# Altium schematic sheet RELAYS.SchDoc
size 594 x 420 mm
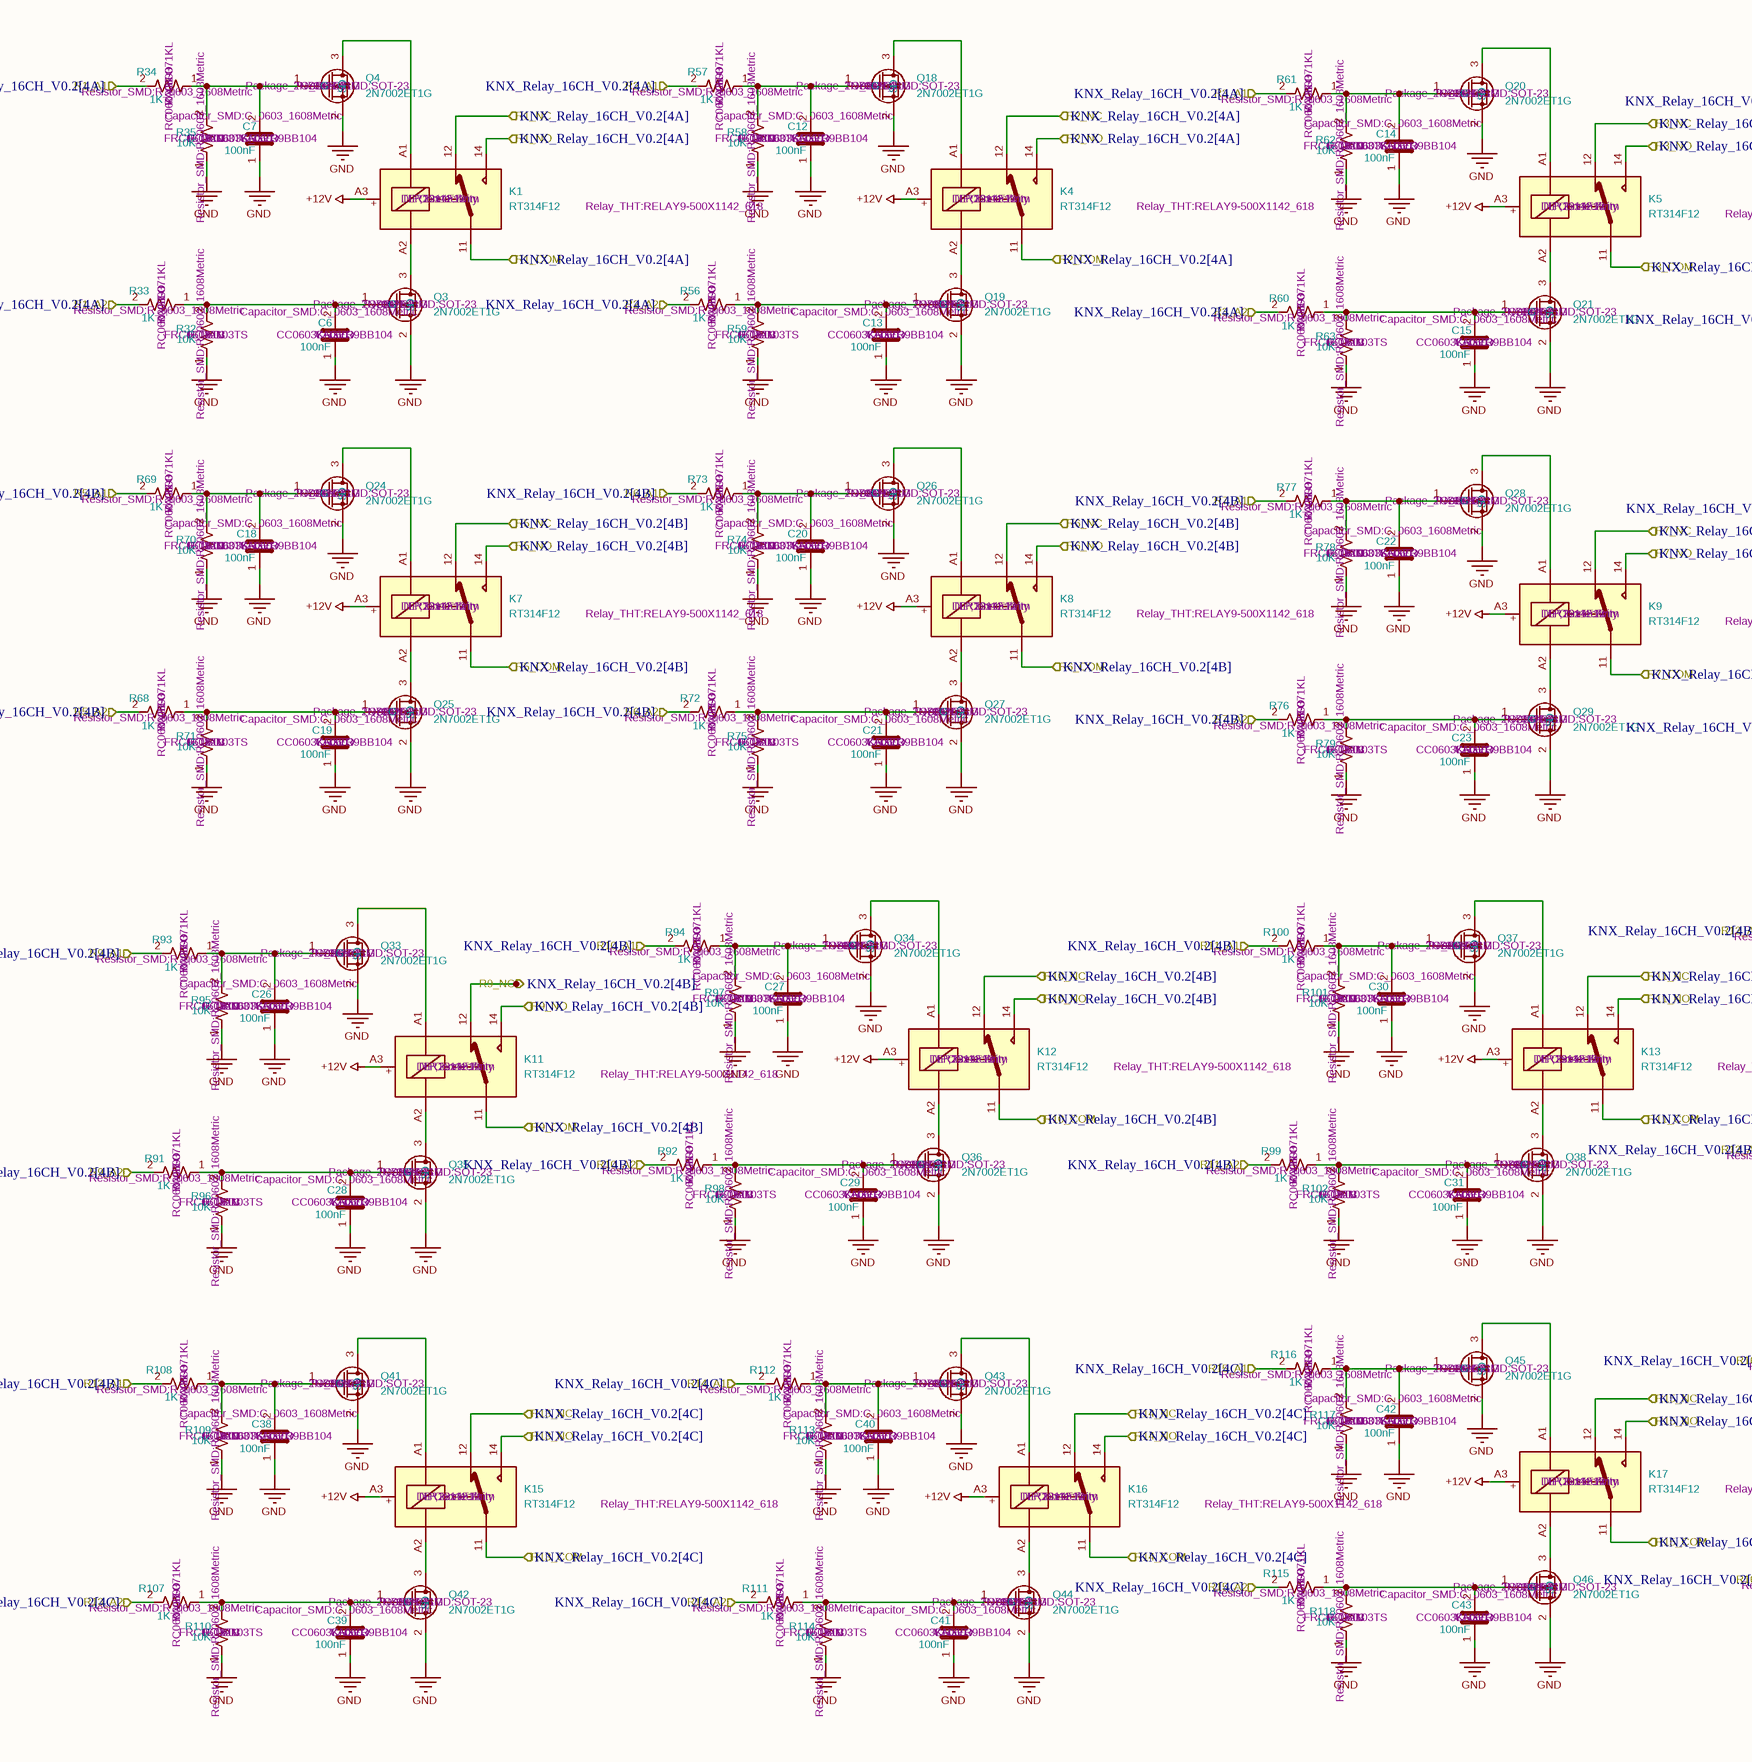
[diagram p0: RELAYS.SchDoc, left]
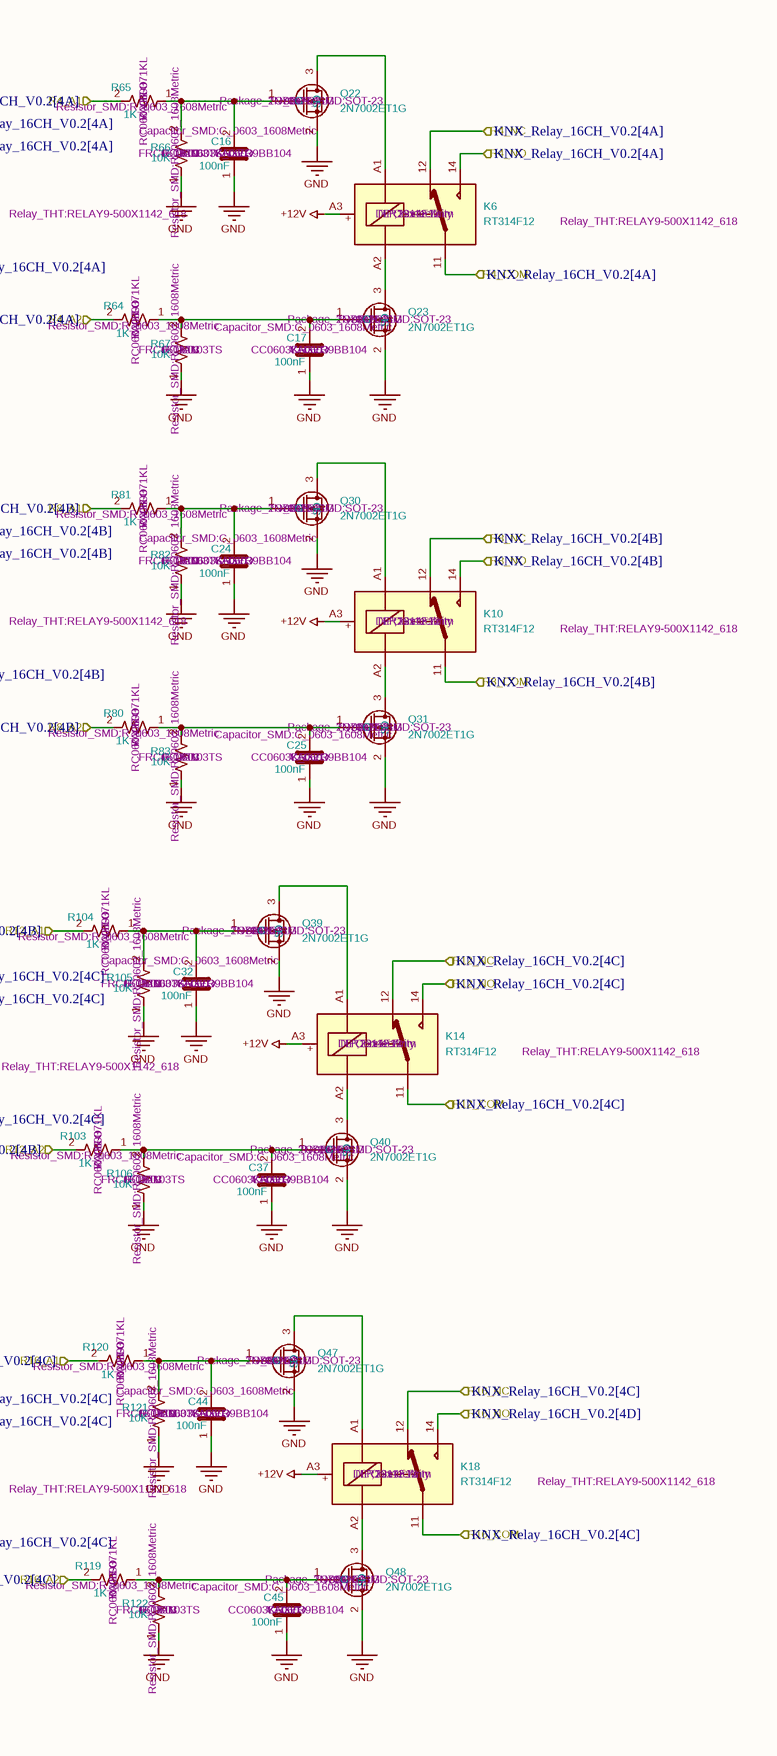
[diagram p1: RELAYS.SchDoc, right]

## Parts
C6  Manufacturer Part Number: CC0603KRX7R9BB104  Manufacturer: YAGEO  Package: C_0603  Footprint: Capacitor_SMD:C_0603_1608Metric  [C_0603_1608Metric]  (hidden comment: 100nF)
C7  Manufacturer Part Number: CC0603KRX7R9BB104  Manufacturer: YAGEO  Package: C_0603  Footprint: Capacitor_SMD:C_0603_1608Metric  [C_0603_1608Metric]  (hidden comment: 100nF)
C12  Manufacturer Part Number: CC0603KRX7R9BB104  Manufacturer: YAGEO  Package: C_0603  Footprint: Capacitor_SMD:C_0603_1608Metric  [C_0603_1608Metric]  (hidden comment: 100nF)
C13  Manufacturer Part Number: CC0603KRX7R9BB104  Manufacturer: YAGEO  Package: C_0603  Footprint: Capacitor_SMD:C_0603_1608Metric  [C_0603_1608Metric]  (hidden comment: 100nF)
C14  Manufacturer Part Number: CC0603KRX7R9BB104  Manufacturer: YAGEO  Package: C_0603  Footprint: Capacitor_SMD:C_0603_1608Metric  [C_0603_1608Metric]  (hidden comment: 100nF)
C15  Manufacturer Part Number: CC0603KRX7R9BB104  Manufacturer: YAGEO  Package: C_0603  Footprint: Capacitor_SMD:C_0603_1608Metric  [C_0603_1608Metric]  (hidden comment: 100nF)
C16  Manufacturer Part Number: CC0603KRX7R9BB104  Manufacturer: YAGEO  Package: C_0603  Footprint: Capacitor_SMD:C_0603_1608Metric  [C_0603_1608Metric]  (hidden comment: 100nF)
C17  Manufacturer Part Number: CC0603KRX7R9BB104  Manufacturer: YAGEO  Package: C_0603  Footprint: Capacitor_SMD:C_0603_1608Metric  [C_0603_1608Metric]  (hidden comment: 100nF)
C18  Manufacturer Part Number: CC0603KRX7R9BB104  Manufacturer: YAGEO  Package: C_0603  Footprint: Capacitor_SMD:C_0603_1608Metric  [C_0603_1608Metric]  (hidden comment: 100nF)
C19  Manufacturer Part Number: CC0603KRX7R9BB104  Manufacturer: YAGEO  Package: C_0603  Footprint: Capacitor_SMD:C_0603_1608Metric  [C_0603_1608Metric]  (hidden comment: 100nF)
C20  Manufacturer Part Number: CC0603KRX7R9BB104  Manufacturer: YAGEO  Package: C_0603  Footprint: Capacitor_SMD:C_0603_1608Metric  [C_0603_1608Metric]  (hidden comment: 100nF)
C21  Manufacturer Part Number: CC0603KRX7R9BB104  Manufacturer: YAGEO  Package: C_0603  Footprint: Capacitor_SMD:C_0603_1608Metric  [C_0603_1608Metric]  (hidden comment: 100nF)
C22  Manufacturer Part Number: CC0603KRX7R9BB104  Manufacturer: YAGEO  Package: C_0603  Footprint: Capacitor_SMD:C_0603_1608Metric  [C_0603_1608Metric]  (hidden comment: 100nF)
C23  Manufacturer Part Number: CC0603KRX7R9BB104  Manufacturer: YAGEO  Package: C_0603  Footprint: Capacitor_SMD:C_0603_1608Metric  [C_0603_1608Metric]  (hidden comment: 100nF)
C24  Manufacturer Part Number: CC0603KRX7R9BB104  Manufacturer: YAGEO  Package: C_0603  Footprint: Capacitor_SMD:C_0603_1608Metric  [C_0603_1608Metric]  (hidden comment: 100nF)
C25  Manufacturer Part Number: CC0603KRX7R9BB104  Manufacturer: YAGEO  Package: C_0603  Footprint: Capacitor_SMD:C_0603_1608Metric  [C_0603_1608Metric]  (hidden comment: 100nF)
C26  Manufacturer Part Number: CC0603KRX7R9BB104  Manufacturer: YAGEO  Package: C_0603  Footprint: Capacitor_SMD:C_0603_1608Metric  [C_0603_1608Metric]  (hidden comment: 100nF)
C27  Manufacturer Part Number: CC0603KRX7R9BB104  Manufacturer: YAGEO  Package: C_0603  Footprint: Capacitor_SMD:C_0603_1608Metric  [C_0603_1608Metric]  (hidden comment: 100nF)
C28  Manufacturer Part Number: CC0603KRX7R9BB104  Manufacturer: YAGEO  Package: C_0603  Footprint: Capacitor_SMD:C_0603_1608Metric  [C_0603_1608Metric]  (hidden comment: 100nF)
C29  Manufacturer Part Number: CC0603KRX7R9BB104  Manufacturer: YAGEO  Package: C_0603  Footprint: Capacitor_SMD:C_0603_1608Metric  [C_0603_1608Metric]  (hidden comment: 100nF)
C30  Manufacturer Part Number: CC0603KRX7R9BB104  Manufacturer: YAGEO  Package: C_0603  Footprint: Capacitor_SMD:C_0603_1608Metric  [C_0603_1608Metric]  (hidden comment: 100nF)
C31  Manufacturer Part Number: CC0603KRX7R9BB104  Manufacturer: YAGEO  Package: C_0603  Footprint: Capacitor_SMD:C_0603_1608Metric  [C_0603_1608Metric]  (hidden comment: 100nF)
C32  Manufacturer Part Number: CC0603KRX7R9BB104  Manufacturer: YAGEO  Package: C_0603  Footprint: Capacitor_SMD:C_0603_1608Metric  [C_0603_1608Metric]  (hidden comment: 100nF)
C37  Manufacturer Part Number: CC0603KRX7R9BB104  Manufacturer: YAGEO  Package: C_0603  Footprint: Capacitor_SMD:C_0603_1608Metric  [C_0603_1608Metric]  (hidden comment: 100nF)
C38  Manufacturer Part Number: CC0603KRX7R9BB104  Manufacturer: YAGEO  Package: C_0603  Footprint: Capacitor_SMD:C_0603_1608Metric  [C_0603_1608Metric]  (hidden comment: 100nF)
C39  Manufacturer Part Number: CC0603KRX7R9BB104  Manufacturer: YAGEO  Package: C_0603  Footprint: Capacitor_SMD:C_0603_1608Metric  [C_0603_1608Metric]  (hidden comment: 100nF)
C40  Manufacturer Part Number: CC0603KRX7R9BB104  Manufacturer: YAGEO  Package: C_0603  Footprint: Capacitor_SMD:C_0603_1608Metric  [C_0603_1608Metric]  (hidden comment: 100nF)
C41  Manufacturer Part Number: CC0603KRX7R9BB104  Manufacturer: YAGEO  Package: C_0603  Footprint: Capacitor_SMD:C_0603_1608Metric  [C_0603_1608Metric]  (hidden comment: 100nF)
C42  Manufacturer Part Number: CC0603KRX7R9BB104  Manufacturer: YAGEO  Package: C_0603  Footprint: Capacitor_SMD:C_0603_1608Metric  [C_0603_1608Metric]  (hidden comment: 100nF)
C43  Manufacturer Part Number: CC0603KRX7R9BB104  Manufacturer: YAGEO  Package: C_0603  Footprint: Capacitor_SMD:C_0603_1608Metric  [C_0603_1608Metric]  (hidden comment: 100nF)
C44  Manufacturer Part Number: CC0603KRX7R9BB104  Manufacturer: YAGEO  Package: C_0603  Footprint: Capacitor_SMD:C_0603_1608Metric  [C_0603_1608Metric]  (hidden comment: 100nF)
C45  Manufacturer Part Number: CC0603KRX7R9BB104  Manufacturer: YAGEO  Package: C_0603  Footprint: Capacitor_SMD:C_0603_1608Metric  [C_0603_1608Metric]  (hidden comment: 100nF)
K1  Manufacturer: TE Connectivity  Package: DIP,29x12.7mm  Footprint: Relay_THT:RELAY9-500X1142_618  [RELAY9-500X1142_618]  (hidden comment: RT314F12)
K4  Manufacturer: TE Connectivity  Package: DIP,29x12.7mm  Footprint: Relay_THT:RELAY9-500X1142_618  [RELAY9-500X1142_618]  (hidden comment: RT314F12)
K5  Manufacturer: TE Connectivity  Package: DIP,29x12.7mm  Footprint: Relay_THT:RELAY9-500X1142_618  [RELAY9-500X1142_618]  (hidden comment: RT314F12)
K6  Manufacturer: TE Connectivity  Package: DIP,29x12.7mm  Footprint: Relay_THT:RELAY9-500X1142_618  [RELAY9-500X1142_618]  (hidden comment: RT314F12)
K7  Manufacturer: TE Connectivity  Package: DIP,29x12.7mm  Footprint: Relay_THT:RELAY9-500X1142_618  [RELAY9-500X1142_618]  (hidden comment: RT314F12)
K8  Manufacturer: TE Connectivity  Package: DIP,29x12.7mm  Footprint: Relay_THT:RELAY9-500X1142_618  [RELAY9-500X1142_618]  (hidden comment: RT314F12)
K9  Manufacturer: TE Connectivity  Package: DIP,29x12.7mm  Footprint: Relay_THT:RELAY9-500X1142_618  [RELAY9-500X1142_618]  (hidden comment: RT314F12)
K10  Manufacturer: TE Connectivity  Package: DIP,29x12.7mm  Footprint: Relay_THT:RELAY9-500X1142_618  [RELAY9-500X1142_618]  (hidden comment: RT314F12)
K11  Manufacturer: TE Connectivity  Package: DIP,29x12.7mm  Footprint: Relay_THT:RELAY9-500X1142_618  [RELAY9-500X1142_618]  (hidden comment: RT314F12)
K12  Manufacturer: TE Connectivity  Package: DIP,29x12.7mm  Footprint: Relay_THT:RELAY9-500X1142_618  [RELAY9-500X1142_618]  (hidden comment: RT314F12)
K13  Manufacturer: TE Connectivity  Package: DIP,29x12.7mm  Footprint: Relay_THT:RELAY9-500X1142_618  [RELAY9-500X1142_618]  (hidden comment: RT314F12)
K14  Manufacturer: TE Connectivity  Package: DIP,29x12.7mm  Footprint: Relay_THT:RELAY9-500X1142_618  [RELAY9-500X1142_618]  (hidden comment: RT314F12)
K15  Manufacturer: TE Connectivity  Package: DIP,29x12.7mm  Footprint: Relay_THT:RELAY9-500X1142_618  [RELAY9-500X1142_618]  (hidden comment: RT314F12)
K16  Manufacturer: TE Connectivity  Package: DIP,29x12.7mm  Footprint: Relay_THT:RELAY9-500X1142_618  [RELAY9-500X1142_618]  (hidden comment: RT314F12)
K17  Manufacturer: TE Connectivity  Package: DIP,29x12.7mm  Footprint: Relay_THT:RELAY9-500X1142_618  [RELAY9-500X1142_618]  (hidden comment: RT314F12)
K18  Manufacturer: TE Connectivity  Package: DIP,29x12.7mm  Footprint: Relay_THT:RELAY9-500X1142_618  [RELAY9-500X1142_618]  (hidden comment: RT314F12)
Q3  Manufacturer: onsemi  Footprint: Package_TO_SOT_SMD:SOT-23  [SOT-23]  (hidden comment: 2N7002ET1G)
Q4  Manufacturer: onsemi  Footprint: Package_TO_SOT_SMD:SOT-23  [SOT-23]  (hidden comment: 2N7002ET1G)
Q18  Manufacturer: onsemi  Footprint: Package_TO_SOT_SMD:SOT-23  [SOT-23]  (hidden comment: 2N7002ET1G)
Q19  Manufacturer: onsemi  Footprint: Package_TO_SOT_SMD:SOT-23  [SOT-23]  (hidden comment: 2N7002ET1G)
Q20  Manufacturer: onsemi  Footprint: Package_TO_SOT_SMD:SOT-23  [SOT-23]  (hidden comment: 2N7002ET1G)
Q21  Manufacturer: onsemi  Footprint: Package_TO_SOT_SMD:SOT-23  [SOT-23]  (hidden comment: 2N7002ET1G)
Q22  Manufacturer: onsemi  Footprint: Package_TO_SOT_SMD:SOT-23  [SOT-23]  (hidden comment: 2N7002ET1G)
Q23  Manufacturer: onsemi  Footprint: Package_TO_SOT_SMD:SOT-23  [SOT-23]  (hidden comment: 2N7002ET1G)
Q24  Manufacturer: onsemi  Footprint: Package_TO_SOT_SMD:SOT-23  [SOT-23]  (hidden comment: 2N7002ET1G)
Q25  Manufacturer: onsemi  Footprint: Package_TO_SOT_SMD:SOT-23  [SOT-23]  (hidden comment: 2N7002ET1G)
Q26  Manufacturer: onsemi  Footprint: Package_TO_SOT_SMD:SOT-23  [SOT-23]  (hidden comment: 2N7002ET1G)
Q27  Manufacturer: onsemi  Footprint: Package_TO_SOT_SMD:SOT-23  [SOT-23]  (hidden comment: 2N7002ET1G)
Q28  Manufacturer: onsemi  Footprint: Package_TO_SOT_SMD:SOT-23  [SOT-23]  (hidden comment: 2N7002ET1G)
Q29  Manufacturer: onsemi  Footprint: Package_TO_SOT_SMD:SOT-23  [SOT-23]  (hidden comment: 2N7002ET1G)
Q30  Manufacturer: onsemi  Footprint: Package_TO_SOT_SMD:SOT-23  [SOT-23]  (hidden comment: 2N7002ET1G)
Q31  Manufacturer: onsemi  Footprint: Package_TO_SOT_SMD:SOT-23  [SOT-23]  (hidden comment: 2N7002ET1G)
Q33  Manufacturer: onsemi  Footprint: Package_TO_SOT_SMD:SOT-23  [SOT-23]  (hidden comment: 2N7002ET1G)
Q34  Manufacturer: onsemi  Footprint: Package_TO_SOT_SMD:SOT-23  [SOT-23]  (hidden comment: 2N7002ET1G)
Q35  Manufacturer: onsemi  Footprint: Package_TO_SOT_SMD:SOT-23  [SOT-23]  (hidden comment: 2N7002ET1G)
Q36  Manufacturer: onsemi  Footprint: Package_TO_SOT_SMD:SOT-23  [SOT-23]  (hidden comment: 2N7002ET1G)
Q37  Manufacturer: onsemi  Footprint: Package_TO_SOT_SMD:SOT-23  [SOT-23]  (hidden comment: 2N7002ET1G)
Q38  Manufacturer: onsemi  Footprint: Package_TO_SOT_SMD:SOT-23  [SOT-23]  (hidden comment: 2N7002ET1G)
Q39  Manufacturer: onsemi  Footprint: Package_TO_SOT_SMD:SOT-23  [SOT-23]  (hidden comment: 2N7002ET1G)
Q40  Manufacturer: onsemi  Footprint: Package_TO_SOT_SMD:SOT-23  [SOT-23]  (hidden comment: 2N7002ET1G)
Q41  Manufacturer: onsemi  Footprint: Package_TO_SOT_SMD:SOT-23  [SOT-23]  (hidden comment: 2N7002ET1G)
Q42  Manufacturer: onsemi  Footprint: Package_TO_SOT_SMD:SOT-23  [SOT-23]  (hidden comment: 2N7002ET1G)
Q43  Manufacturer: onsemi  Footprint: Package_TO_SOT_SMD:SOT-23  [SOT-23]  (hidden comment: 2N7002ET1G)
Q44  Manufacturer: onsemi  Footprint: Package_TO_SOT_SMD:SOT-23  [SOT-23]  (hidden comment: 2N7002ET1G)
Q45  Manufacturer: onsemi  Footprint: Package_TO_SOT_SMD:SOT-23  [SOT-23]  (hidden comment: 2N7002ET1G)
Q46  Manufacturer: onsemi  Footprint: Package_TO_SOT_SMD:SOT-23  [SOT-23]  (hidden comment: 2N7002ET1G)
Q47  Manufacturer: onsemi  Footprint: Package_TO_SOT_SMD:SOT-23  [SOT-23]  (hidden comment: 2N7002ET1G)
Q48  Manufacturer: onsemi  Footprint: Package_TO_SOT_SMD:SOT-23  [SOT-23]  (hidden comment: 2N7002ET1G)
R32  Manufacturer Part Number: FRC0603J103TS  Manufacturer: FOJAN  Package: R_0603  Footprint: Resistor_SMD:R_0603_1608Metric  [R_0603_1608Metric]  (hidden comment: 10K)
R33  Manufacturer Part Number: RC0603JR-071KL  Manufacturer: YAGEO  Package: R_0603  Footprint: Resistor_SMD:R_0603_1608Metric  [R_0603_1608Metric]  (hidden comment: 1K)
R34  Manufacturer Part Number: RC0603JR-071KL  Manufacturer: YAGEO  Package: R_0603  Footprint: Resistor_SMD:R_0603_1608Metric  [R_0603_1608Metric]  (hidden comment: 1K)
R35  Manufacturer Part Number: FRC0603J103TS  Manufacturer: FOJAN  Package: R_0603  Footprint: Resistor_SMD:R_0603_1608Metric  [R_0603_1608Metric]  (hidden comment: 10K)
R56  Manufacturer Part Number: RC0603JR-071KL  Manufacturer: YAGEO  Package: R_0603  Footprint: Resistor_SMD:R_0603_1608Metric  [R_0603_1608Metric]  (hidden comment: 1K)
R57  Manufacturer Part Number: RC0603JR-071KL  Manufacturer: YAGEO  Package: R_0603  Footprint: Resistor_SMD:R_0603_1608Metric  [R_0603_1608Metric]  (hidden comment: 1K)
R58  Manufacturer Part Number: FRC0603J103TS  Manufacturer: FOJAN  Package: R_0603  Footprint: Resistor_SMD:R_0603_1608Metric  [R_0603_1608Metric]  (hidden comment: 10K)
R59  Manufacturer Part Number: FRC0603J103TS  Manufacturer: FOJAN  Package: R_0603  Footprint: Resistor_SMD:R_0603_1608Metric  [R_0603_1608Metric]  (hidden comment: 10K)
R60  Manufacturer Part Number: RC0603JR-071KL  Manufacturer: YAGEO  Package: R_0603  Footprint: Resistor_SMD:R_0603_1608Metric  [R_0603_1608Metric]  (hidden comment: 1K)
R61  Manufacturer Part Number: RC0603JR-071KL  Manufacturer: YAGEO  Package: R_0603  Footprint: Resistor_SMD:R_0603_1608Metric  [R_0603_1608Metric]  (hidden comment: 1K)
R62  Manufacturer Part Number: FRC0603J103TS  Manufacturer: FOJAN  Package: R_0603  Footprint: Resistor_SMD:R_0603_1608Metric  [R_0603_1608Metric]  (hidden comment: 10K)
R63  Manufacturer Part Number: FRC0603J103TS  Manufacturer: FOJAN  Package: R_0603  Footprint: Resistor_SMD:R_0603_1608Metric  [R_0603_1608Metric]  (hidden comment: 10K)
R64  Manufacturer Part Number: RC0603JR-071KL  Manufacturer: YAGEO  Package: R_0603  Footprint: Resistor_SMD:R_0603_1608Metric  [R_0603_1608Metric]  (hidden comment: 1K)
R65  Manufacturer Part Number: RC0603JR-071KL  Manufacturer: YAGEO  Package: R_0603  Footprint: Resistor_SMD:R_0603_1608Metric  [R_0603_1608Metric]  (hidden comment: 1K)
R66  Manufacturer Part Number: FRC0603J103TS  Manufacturer: FOJAN  Package: R_0603  Footprint: Resistor_SMD:R_0603_1608Metric  [R_0603_1608Metric]  (hidden comment: 10K)
R67  Manufacturer Part Number: FRC0603J103TS  Manufacturer: FOJAN  Package: R_0603  Footprint: Resistor_SMD:R_0603_1608Metric  [R_0603_1608Metric]  (hidden comment: 10K)
R68  Manufacturer Part Number: RC0603JR-071KL  Manufacturer: YAGEO  Package: R_0603  Footprint: Resistor_SMD:R_0603_1608Metric  [R_0603_1608Metric]  (hidden comment: 1K)
R69  Manufacturer Part Number: RC0603JR-071KL  Manufacturer: YAGEO  Package: R_0603  Footprint: Resistor_SMD:R_0603_1608Metric  [R_0603_1608Metric]  (hidden comment: 1K)
R70  Manufacturer Part Number: FRC0603J103TS  Manufacturer: FOJAN  Package: R_0603  Footprint: Resistor_SMD:R_0603_1608Metric  [R_0603_1608Metric]  (hidden comment: 10K)
R71  Manufacturer Part Number: FRC0603J103TS  Manufacturer: FOJAN  Package: R_0603  Footprint: Resistor_SMD:R_0603_1608Metric  [R_0603_1608Metric]  (hidden comment: 10K)
R72  Manufacturer Part Number: RC0603JR-071KL  Manufacturer: YAGEO  Package: R_0603  Footprint: Resistor_SMD:R_0603_1608Metric  [R_0603_1608Metric]  (hidden comment: 1K)
R73  Manufacturer Part Number: RC0603JR-071KL  Manufacturer: YAGEO  Package: R_0603  Footprint: Resistor_SMD:R_0603_1608Metric  [R_0603_1608Metric]  (hidden comment: 1K)
R74  Manufacturer Part Number: FRC0603J103TS  Manufacturer: FOJAN  Package: R_0603  Footprint: Resistor_SMD:R_0603_1608Metric  [R_0603_1608Metric]  (hidden comment: 10K)
R75  Manufacturer Part Number: FRC0603J103TS  Manufacturer: FOJAN  Package: R_0603  Footprint: Resistor_SMD:R_0603_1608Metric  [R_0603_1608Metric]  (hidden comment: 10K)
R76  Manufacturer Part Number: RC0603JR-071KL  Manufacturer: YAGEO  Package: R_0603  Footprint: Resistor_SMD:R_0603_1608Metric  [R_0603_1608Metric]  (hidden comment: 1K)
R77  Manufacturer Part Number: RC0603JR-071KL  Manufacturer: YAGEO  Package: R_0603  Footprint: Resistor_SMD:R_0603_1608Metric  [R_0603_1608Metric]  (hidden comment: 1K)
R78  Manufacturer Part Number: FRC0603J103TS  Manufacturer: FOJAN  Package: R_0603  Footprint: Resistor_SMD:R_0603_1608Metric  [R_0603_1608Metric]  (hidden comment: 10K)
R79  Manufacturer Part Number: FRC0603J103TS  Manufacturer: FOJAN  Package: R_0603  Footprint: Resistor_SMD:R_0603_1608Metric  [R_0603_1608Metric]  (hidden comment: 10K)
R80  Manufacturer Part Number: RC0603JR-071KL  Manufacturer: YAGEO  Package: R_0603  Footprint: Resistor_SMD:R_0603_1608Metric  [R_0603_1608Metric]  (hidden comment: 1K)
R81  Manufacturer Part Number: RC0603JR-071KL  Manufacturer: YAGEO  Package: R_0603  Footprint: Resistor_SMD:R_0603_1608Metric  [R_0603_1608Metric]  (hidden comment: 1K)
R82  Manufacturer Part Number: FRC0603J103TS  Manufacturer: FOJAN  Package: R_0603  Footprint: Resistor_SMD:R_0603_1608Metric  [R_0603_1608Metric]  (hidden comment: 10K)
R83  Manufacturer Part Number: FRC0603J103TS  Manufacturer: FOJAN  Package: R_0603  Footprint: Resistor_SMD:R_0603_1608Metric  [R_0603_1608Metric]  (hidden comment: 10K)
R91  Manufacturer Part Number: RC0603JR-071KL  Manufacturer: YAGEO  Package: R_0603  Footprint: Resistor_SMD:R_0603_1608Metric  [R_0603_1608Metric]  (hidden comment: 1K)
R92  Manufacturer Part Number: RC0603JR-071KL  Manufacturer: YAGEO  Package: R_0603  Footprint: Resistor_SMD:R_0603_1608Metric  [R_0603_1608Metric]  (hidden comment: 1K)
R93  Manufacturer Part Number: RC0603JR-071KL  Manufacturer: YAGEO  Package: R_0603  Footprint: Resistor_SMD:R_0603_1608Metric  [R_0603_1608Metric]  (hidden comment: 1K)
R94  Manufacturer Part Number: RC0603JR-071KL  Manufacturer: YAGEO  Package: R_0603  Footprint: Resistor_SMD:R_0603_1608Metric  [R_0603_1608Metric]  (hidden comment: 1K)
R95  Manufacturer Part Number: FRC0603J103TS  Manufacturer: FOJAN  Package: R_0603  Footprint: Resistor_SMD:R_0603_1608Metric  [R_0603_1608Metric]  (hidden comment: 10K)
R96  Manufacturer Part Number: FRC0603J103TS  Manufacturer: FOJAN  Package: R_0603  Footprint: Resistor_SMD:R_0603_1608Metric  [R_0603_1608Metric]  (hidden comment: 10K)
R97  Manufacturer Part Number: FRC0603J103TS  Manufacturer: FOJAN  Package: R_0603  Footprint: Resistor_SMD:R_0603_1608Metric  [R_0603_1608Metric]  (hidden comment: 10K)
R98  Manufacturer Part Number: FRC0603J103TS  Manufacturer: FOJAN  Package: R_0603  Footprint: Resistor_SMD:R_0603_1608Metric  [R_0603_1608Metric]  (hidden comment: 10K)
R99  Manufacturer Part Number: RC0603JR-071KL  Manufacturer: YAGEO  Package: R_0603  Footprint: Resistor_SMD:R_0603_1608Metric  [R_0603_1608Metric]  (hidden comment: 1K)
R100  Manufacturer Part Number: RC0603JR-071KL  Manufacturer: YAGEO  Package: R_0603  Footprint: Resistor_SMD:R_0603_1608Metric  [R_0603_1608Metric]  (hidden comment: 1K)
R101  Manufacturer Part Number: FRC0603J103TS  Manufacturer: FOJAN  Package: R_0603  Footprint: Resistor_SMD:R_0603_1608Metric  [R_0603_1608Metric]  (hidden comment: 10K)
R102  Manufacturer Part Number: FRC0603J103TS  Manufacturer: FOJAN  Package: R_0603  Footprint: Resistor_SMD:R_0603_1608Metric  [R_0603_1608Metric]  (hidden comment: 10K)
R103  Manufacturer Part Number: RC0603JR-071KL  Manufacturer: YAGEO  Package: R_0603  Footprint: Resistor_SMD:R_0603_1608Metric  [R_0603_1608Metric]  (hidden comment: 1K)
R104  Manufacturer Part Number: RC0603JR-071KL  Manufacturer: YAGEO  Package: R_0603  Footprint: Resistor_SMD:R_0603_1608Metric  [R_0603_1608Metric]  (hidden comment: 1K)
R105  Manufacturer Part Number: FRC0603J103TS  Manufacturer: FOJAN  Package: R_0603  Footprint: Resistor_SMD:R_0603_1608Metric  [R_0603_1608Metric]  (hidden comment: 10K)
R106  Manufacturer Part Number: FRC0603J103TS  Manufacturer: FOJAN  Package: R_0603  Footprint: Resistor_SMD:R_0603_1608Metric  [R_0603_1608Metric]  (hidden comment: 10K)
R107  Manufacturer Part Number: RC0603JR-071KL  Manufacturer: YAGEO  Package: R_0603  Footprint: Resistor_SMD:R_0603_1608Metric  [R_0603_1608Metric]  (hidden comment: 1K)
R108  Manufacturer Part Number: RC0603JR-071KL  Manufacturer: YAGEO  Package: R_0603  Footprint: Resistor_SMD:R_0603_1608Metric  [R_0603_1608Metric]  (hidden comment: 1K)
R109  Manufacturer Part Number: FRC0603J103TS  Manufacturer: FOJAN  Package: R_0603  Footprint: Resistor_SMD:R_0603_1608Metric  [R_0603_1608Metric]  (hidden comment: 10K)
R110  Manufacturer Part Number: FRC0603J103TS  Manufacturer: FOJAN  Package: R_0603  Footprint: Resistor_SMD:R_0603_1608Metric  [R_0603_1608Metric]  (hidden comment: 10K)
R111  Manufacturer Part Number: RC0603JR-071KL  Manufacturer: YAGEO  Package: R_0603  Footprint: Resistor_SMD:R_0603_1608Metric  [R_0603_1608Metric]  (hidden comment: 1K)
R112  Manufacturer Part Number: RC0603JR-071KL  Manufacturer: YAGEO  Package: R_0603  Footprint: Resistor_SMD:R_0603_1608Metric  [R_0603_1608Metric]  (hidden comment: 1K)
R113  Manufacturer Part Number: FRC0603J103TS  Manufacturer: FOJAN  Package: R_0603  Footprint: Resistor_SMD:R_0603_1608Metric  [R_0603_1608Metric]  (hidden comment: 10K)
R114  Manufacturer Part Number: FRC0603J103TS  Manufacturer: FOJAN  Package: R_0603  Footprint: Resistor_SMD:R_0603_1608Metric  [R_0603_1608Metric]  (hidden comment: 10K)
R115  Manufacturer Part Number: RC0603JR-071KL  Manufacturer: YAGEO  Package: R_0603  Footprint: Resistor_SMD:R_0603_1608Metric  [R_0603_1608Metric]  (hidden comment: 1K)
R116  Manufacturer Part Number: RC0603JR-071KL  Manufacturer: YAGEO  Package: R_0603  Footprint: Resistor_SMD:R_0603_1608Metric  [R_0603_1608Metric]  (hidden comment: 1K)
R117  Manufacturer Part Number: FRC0603J103TS  Manufacturer: FOJAN  Package: R_0603  Footprint: Resistor_SMD:R_0603_1608Metric  [R_0603_1608Metric]  (hidden comment: 10K)
R118  Manufacturer Part Number: FRC0603J103TS  Manufacturer: FOJAN  Package: R_0603  Footprint: Resistor_SMD:R_0603_1608Metric  [R_0603_1608Metric]  (hidden comment: 10K)
R119  Manufacturer Part Number: RC0603JR-071KL  Manufacturer: YAGEO  Package: R_0603  Footprint: Resistor_SMD:R_0603_1608Metric  [R_0603_1608Metric]  (hidden comment: 1K)
R120  Manufacturer Part Number: RC0603JR-071KL  Manufacturer: YAGEO  Package: R_0603  Footprint: Resistor_SMD:R_0603_1608Metric  [R_0603_1608Metric]  (hidden comment: 1K)
R121  Manufacturer Part Number: FRC0603J103TS  Manufacturer: FOJAN  Package: R_0603  Footprint: Resistor_SMD:R_0603_1608Metric  [R_0603_1608Metric]  (hidden comment: 10K)
R122  Manufacturer Part Number: FRC0603J103TS  Manufacturer: FOJAN  Package: R_0603  Footprint: Resistor_SMD:R_0603_1608Metric  [R_0603_1608Metric]  (hidden comment: 10K)

## Ports
R1_A1 (in, see KNX_Relay_16CH_V0.2[4A]), R1_A2 (in, see KNX_Relay_16CH_V0.2[4A]), R1_COM (in, see KNX_Relay_16CH_V0.2[4A]), R1_NC (in, see KNX_Relay_16CH_V0.2[4A]), R1_NO (in, see KNX_Relay_16CH_V0.2[4A]), R2_A1 (in, see KNX_Relay_16CH_V0.2[4A]), R2_A2 (in, see KNX_Relay_16CH_V0.2[4A]), R2_COM (in, see KNX_Relay_16CH_V0.2[4A]), R2_NC (in, see KNX_Relay_16CH_V0.2[4A]), R2_NO (in, see KNX_Relay_16CH_V0.2[4A]), R3_A1 (in, see KNX_Relay_16CH_V0.2[4A]), R3_A2 (in, see KNX_Relay_16CH_V0.2[4A]), R3_COM (in, see KNX_Relay_16CH_V0.2[4A]), R3_NC (in, see KNX_Relay_16CH_V0.2[4A]), R3_NO (in, see KNX_Relay_16CH_V0.2[4A]), R4_A1 (in, see KNX_Relay_16CH_V0.2[4A]), R4_A2 (in, see KNX_Relay_16CH_V0.2[4A]), R4_COM (in, see KNX_Relay_16CH_V0.2[4A]), R4_NC (in, see KNX_Relay_16CH_V0.2[4A]), R4_NO (in, see KNX_Relay_16CH_V0.2[4A]), R5_A1 (in, see KNX_Relay_16CH_V0.2[4B]), R5_A2 (in, see KNX_Relay_16CH_V0.2[4B]), R5_COM (in, see KNX_Relay_16CH_V0.2[4B]), R5_NC (in, see KNX_Relay_16CH_V0.2[4B]), R5_NO (in, see KNX_Relay_16CH_V0.2[4B]), R6_A1 (in, see KNX_Relay_16CH_V0.2[4B]), R6_A2 (in, see KNX_Relay_16CH_V0.2[4B]), R6_COM (in, see KNX_Relay_16CH_V0.2[4B]), R6_NC (in, see KNX_Relay_16CH_V0.2[4B]), R6_NO (in, see KNX_Relay_16CH_V0.2[4B]), R7_A1 (in, see KNX_Relay_16CH_V0.2[4B]), R7_A2 (in, see KNX_Relay_16CH_V0.2[4B]), R7_COM (in, see KNX_Relay_16CH_V0.2[4B]), R7_NC (in, see KNX_Relay_16CH_V0.2[4B]), R7_NO (in, see KNX_Relay_16CH_V0.2[4B]), R8_A1 (in, see KNX_Relay_16CH_V0.2[4B]), R8_A2 (in, see KNX_Relay_16CH_V0.2[4B]), R8_COM (in, see KNX_Relay_16CH_V0.2[4B]), R8_NC (in, see KNX_Relay_16CH_V0.2[4B]), R8_NO (in, see KNX_Relay_16CH_V0.2[4B]), R9_A1 (in, see KNX_Relay_16CH_V0.2[4B]), R9_A2 (in, see KNX_Relay_16CH_V0.2[4B]), R9_COM (in, see KNX_Relay_16CH_V0.2[4B]), R9_NC (in, see KNX_Relay_16CH_V0.2[4B]), R9_NO (in, see KNX_Relay_16CH_V0.2[4B]), R10_A1 (in, see KNX_Relay_16CH_V0.2[4B]), R10_A2 (in, see KNX_Relay_16CH_V0.2[4B]), R10_COM (in, see KNX_Relay_16CH_V0.2[4B]), R10_NC (in, see KNX_Relay_16CH_V0.2[4B]), R10_NO (in, see KNX_Relay_16CH_V0.2[4B]), R11_A1 (in, see KNX_Relay_16CH_V0.2[4B]), R11_A2 (in, see KNX_Relay_16CH_V0.2[4B]), R11_COM (in, see KNX_Relay_16CH_V0.2[4C]), R11_NC (in, see KNX_Relay_16CH_V0.2[4C]), R11_NO (in, see KNX_Relay_16CH_V0.2[4C]), R12_A1 (in, see KNX_Relay_16CH_V0.2[4B]), R12_A2 (in, see KNX_Relay_16CH_V0.2[4B]), R12_COM (in, see KNX_Relay_16CH_V0.2[4C]), R12_NC (in, see KNX_Relay_16CH_V0.2[4C]), R12_NO (in, see KNX_Relay_16CH_V0.2[4C]), R13_A1 (in, see KNX_Relay_16CH_V0.2[4B]), R13_A2 (in, see KNX_Relay_16CH_V0.2[4C]), R13_COM (in, see KNX_Relay_16CH_V0.2[4C]), R13_NC (in, see KNX_Relay_16CH_V0.2[4C]), R13_NO (in, see KNX_Relay_16CH_V0.2[4C]), R14_A1 (in, see KNX_Relay_16CH_V0.2[4C]), R14_A2 (in, see KNX_Relay_16CH_V0.2[4C]), R14_COM (in, see KNX_Relay_16CH_V0.2[4C]), R14_NC (in, see KNX_Relay_16CH_V0.2[4C]), R14_NO (in, see KNX_Relay_16CH_V0.2[4C]), R15_A1 (in, see KNX_Relay_16CH_V0.2[4C]), R15_A2 (in, see KNX_Relay_16CH_V0.2[4C]), R15_COM (in, see KNX_Relay_16CH_V0.2[4C]), R15_NC (in, see KNX_Relay_16CH_V0.2[4C]), R15_NO (in, see KNX_Relay_16CH_V0.2[4C]), R16_A1 (in, see KNX_Relay_16CH_V0.2[4C]), R16_A2 (in, see KNX_Relay_16CH_V0.2[4C]), R16_COM (in, see KNX_Relay_16CH_V0.2[4C]), R16_NC (in, see KNX_Relay_16CH_V0.2[4C]), R16_NO (in, see KNX_Relay_16CH_V0.2[4D])

## Nets
+12V: K1.A3 K4.A3 K5.A3 K6.A3 K7.A3 K8.A3 K9.A3 K10.A3 K11.A3 K12.A3 K13.A3 K14.A3 K15.A3 K16.A3 K17.A3 K18.A3
GND: C6.1 C7.1 C12.1 C13.1 C14.1 C15.1 C16.1 C17.1 C18.1 C19.1 C20.1 C21.1 C22.1 C23.1 C24.1 C25.1 C26.1 C27.1 C28.1 C29.1 C30.1 C31.1 C32.1 C37.1 C38.1 C39.1 C40.1 C41.1 C42.1 C43.1 C44.1 C45.1 Q3.2(S) Q4.2(S) Q18.2(S) Q19.2(S) Q20.2(S) Q21.2(S) Q22.2(S) Q23.2(S) Q24.2(S) Q25.2(S) Q26.2(S) Q27.2(S) Q28.2(S) Q29.2(S) Q30.2(S) Q31.2(S) Q33.2(S) Q34.2(S) Q35.2(S) Q36.2(S) Q37.2(S) Q38.2(S) Q39.2(S) Q40.2(S) Q41.2(S) Q42.2(S) Q43.2(S) Q44.2(S) Q45.2(S) Q46.2(S) Q47.2(S) Q48.2(S) R32.1 R35.1 R58.1 R59.1 R62.1 R63.1 R66.1 R67.1 R70.1 R71.1 R74.1 R75.1 R78.1 R79.1 R82.1 R83.1 R95.1 R96.1 R97.1 R98.1 R101.1 R102.1 R105.1 R106.1 R109.1 R110.1 R113.1 R114.1 R117.1 R118.1 R121.1 R122.1
R1_A1: R34.2 ; port R1_A1
R1_A2: R33.2 ; port R1_A2
R1_COM: K1.11 ; port R1_COM
R1_NC: K1.12 ; port R1_NC
R1_NO: K1.14 ; port R1_NO
R2_A1: R57.2 ; port R2_A1
R2_A2: R56.2 ; port R2_A2
R2_COM: K4.11 ; port R2_COM
R2_NC: K4.12 ; port R2_NC
R2_NO: K4.14 ; port R2_NO
R3_A1: R61.2 ; port R3_A1
R3_A2: R60.2 ; port R3_A2
R3_COM: K5.11 ; port R3_COM
R3_NC: K5.12 ; port R3_NC
R3_NO: K5.14 ; port R3_NO
R4_A1: R65.2 ; port R4_A1
R4_A2: R64.2 ; port R4_A2
R4_COM: K6.11 ; port R4_COM
R4_NC: K6.12 ; port R4_NC
R4_NO: K6.14 ; port R4_NO
R5_A1: R69.2 ; port R5_A1
R5_A2: R68.2 ; port R5_A2
R5_COM: K7.11 ; port R5_COM
R5_NC: K7.12 ; port R5_NC
R5_NO: K7.14 ; port R5_NO
R6_A1: R73.2 ; port R6_A1
R6_A2: R72.2 ; port R6_A2
R6_COM: K8.11 ; port R6_COM
R6_NC: K8.12 ; port R6_NC
R6_NO: K8.14 ; port R6_NO
R7_A1: R77.2 ; port R7_A1
R7_A2: R76.2 ; port R7_A2
R7_COM: K9.11 ; port R7_COM
R7_NC: K9.12 ; port R7_NC
R7_NO: K9.14 ; port R7_NO
R8_A1: R81.2 ; port R8_A1
R8_A2: R80.2 ; port R8_A2
R8_COM: K10.11 ; port R8_COM
R8_NC: K10.12 ; port R8_NC
R8_NO: K10.14 ; port R8_NO
R9_A1: R93.2 ; port R9_A1
R9_A2: R91.2 ; port R9_A2
R9_COM: K11.11 ; port R9_COM
R9_NC: K11.12 ; port R9_NC
R9_NO: K11.14 ; port R9_NO
R10_A1: R94.2 ; port R10_A1
R10_A2: R92.2 ; port R10_A2
R10_COM: K12.11 ; port R10_COM
R10_NC: K12.12 ; port R10_NC
R10_NO: K12.14 ; port R10_NO
R11_A1: R100.2 ; port R11_A1
R11_A2: R99.2 ; port R11_A2
R11_COM: K13.11 ; port R11_COM
R11_NC: K13.12 ; port R11_NC
R11_NO: K13.14 ; port R11_NO
R12_A1: R104.2 ; port R12_A1
R12_A2: R103.2 ; port R12_A2
R12_COM: K14.11 ; port R12_COM
R12_NC: K14.12 ; port R12_NC
R12_NO: K14.14 ; port R12_NO
R13_A1: R108.2 ; port R13_A1
R13_A2: R107.2 ; port R13_A2
R13_COM: K15.11 ; port R13_COM
R13_NC: K15.12 ; port R13_NC
R13_NO: K15.14 ; port R13_NO
R14_A1: R112.2 ; port R14_A1
R14_A2: R111.2 ; port R14_A2
R14_COM: K16.11 ; port R14_COM
R14_NC: K16.12 ; port R14_NC
R14_NO: K16.14 ; port R14_NO
R15_A1: R116.2 ; port R15_A1
R15_A2: R115.2 ; port R15_A2
R15_COM: K17.11 ; port R15_COM
R15_NC: K17.12 ; port R15_NC
R15_NO: K17.14 ; port R15_NO
R16_A1: R120.2 ; port R16_A1
R16_A2: R119.2 ; port R16_A2
R16_COM: K18.11 ; port R16_COM
R16_NC: K18.12 ; port R16_NC
R16_NO: K18.14 ; port R16_NO
NetC6_2: C6.2 Q3.1(G) R32.2 R33.1
NetC7_2: C7.2 Q4.1(G) R34.1 R35.2
NetC12_2: C12.2 Q18.1(G) R57.1 R58.2
NetC13_2: C13.2 Q19.1(G) R56.1 R59.2
NetC14_2: C14.2 Q20.1(G) R61.1 R62.2
NetC15_2: C15.2 Q21.1(G) R60.1 R63.2
NetC16_2: C16.2 Q22.1(G) R65.1 R66.2
NetC17_2: C17.2 Q23.1(G) R64.1 R67.2
NetC18_2: C18.2 Q24.1(G) R69.1 R70.2
NetC19_2: C19.2 Q25.1(G) R68.1 R71.2
NetC20_2: C20.2 Q26.1(G) R73.1 R74.2
NetC21_2: C21.2 Q27.1(G) R72.1 R75.2
NetC22_2: C22.2 Q28.1(G) R77.1 R78.2
NetC23_2: C23.2 Q29.1(G) R76.1 R79.2
NetC24_2: C24.2 Q30.1(G) R81.1 R82.2
NetC25_2: C25.2 Q31.1(G) R80.1 R83.2
NetC26_2: C26.2 Q33.1(G) R93.1 R95.2
NetC27_2: C27.2 Q34.1(G) R94.1 R97.2
NetC28_2: C28.2 Q35.1(G) R91.1 R96.2
NetC29_2: C29.2 Q36.1(G) R92.1 R98.2
NetC30_2: C30.2 Q37.1(G) R100.1 R101.2
NetC31_2: C31.2 Q38.1(G) R99.1 R102.2
NetC32_2: C32.2 Q39.1(G) R104.1 R105.2
NetC37_2: C37.2 Q40.1(G) R103.1 R106.2
NetC38_2: C38.2 Q41.1(G) R108.1 R109.2
NetC39_2: C39.2 Q42.1(G) R107.1 R110.2
NetC40_2: C40.2 Q43.1(G) R112.1 R113.2
NetC41_2: C41.2 Q44.1(G) R111.1 R114.2
NetC42_2: C42.2 Q45.1(G) R116.1 R117.2
NetC43_2: C43.2 Q46.1(G) R115.1 R118.2
NetC44_2: C44.2 Q47.1(G) R120.1 R121.2
NetC45_2: C45.2 Q48.1(G) R119.1 R122.2
NetK1_A1: K1.A1 Q4.3(D)
NetK1_A2: K1.A2 Q3.3(D)
NetK4_A1: K4.A1 Q18.3(D)
NetK4_A2: K4.A2 Q19.3(D)
NetK5_A1: K5.A1 Q20.3(D)
NetK5_A2: K5.A2 Q21.3(D)
NetK6_A1: K6.A1 Q22.3(D)
NetK6_A2: K6.A2 Q23.3(D)
NetK7_A1: K7.A1 Q24.3(D)
NetK7_A2: K7.A2 Q25.3(D)
NetK8_A1: K8.A1 Q26.3(D)
NetK8_A2: K8.A2 Q27.3(D)
NetK9_A1: K9.A1 Q28.3(D)
NetK9_A2: K9.A2 Q29.3(D)
NetK10_A1: K10.A1 Q30.3(D)
NetK10_A2: K10.A2 Q31.3(D)
NetK11_A1: K11.A1 Q33.3(D)
NetK11_A2: K11.A2 Q35.3(D)
NetK12_A1: K12.A1 Q34.3(D)
NetK12_A2: K12.A2 Q36.3(D)
NetK13_A1: K13.A1 Q37.3(D)
NetK13_A2: K13.A2 Q38.3(D)
NetK14_A1: K14.A1 Q39.3(D)
NetK14_A2: K14.A2 Q40.3(D)
NetK15_A1: K15.A1 Q41.3(D)
NetK15_A2: K15.A2 Q42.3(D)
NetK16_A1: K16.A1 Q43.3(D)
NetK16_A2: K16.A2 Q44.3(D)
NetK17_A1: K17.A1 Q45.3(D)
NetK17_A2: K17.A2 Q46.3(D)
NetK18_A1: K18.A1 Q47.3(D)
NetK18_A2: K18.A2 Q48.3(D)

## Notes on the sheet
- 1
- 2
- 3
- 4
- 5
- 6
- 7
- 8
- 9
- 10
- 11
- A
- B
- C
- D
- E
- F
- G
- H
- Title:
- File: RELAYS.kicad_sch
- Sheet: /
- KiCad E.D.A.  kicad (5.1.4)-1
- Size: A2
- Date:
- Rev:
- Id: 1/1
- (in symbol RT314A03) +

## Library data of the parts
C6 C7 C12-C32 C37-C45 = C_3: Value: 100nF
K1 K4-K18 = RT314A03: Manufacturer Part Number: RT314F12; Value: RT314F12
Q3 Q4 Q18-Q31 Q33-Q48 = Q_NMOS_Depletion_GSD: Manufacturer Part Number: 2N7002ET1G; Package: SOT-23; Value: 2N7002ET1G
R32-R35 R56-R83 R91-R122 = R_US
  R32 R35 R58 R59 R62 R63 R66 R67 R70 R71 R74 R75 R78 R79 R82 R83 R95-R98 R101 R102 R105 R106 R109 R110 R113 R114 R117 R118 R121 R122: Value: 10K
  R33 R34 R56 R57 R60 R61 R64 R65 R68 R69 R72 R73 R76 R77 R80 R81 R91-R94 R99 R100 R103 R104 R107 R108 R111 R112 R115 R116 R119 R120: Value: 1K